# Altium project PCB_Project.PrjPcb
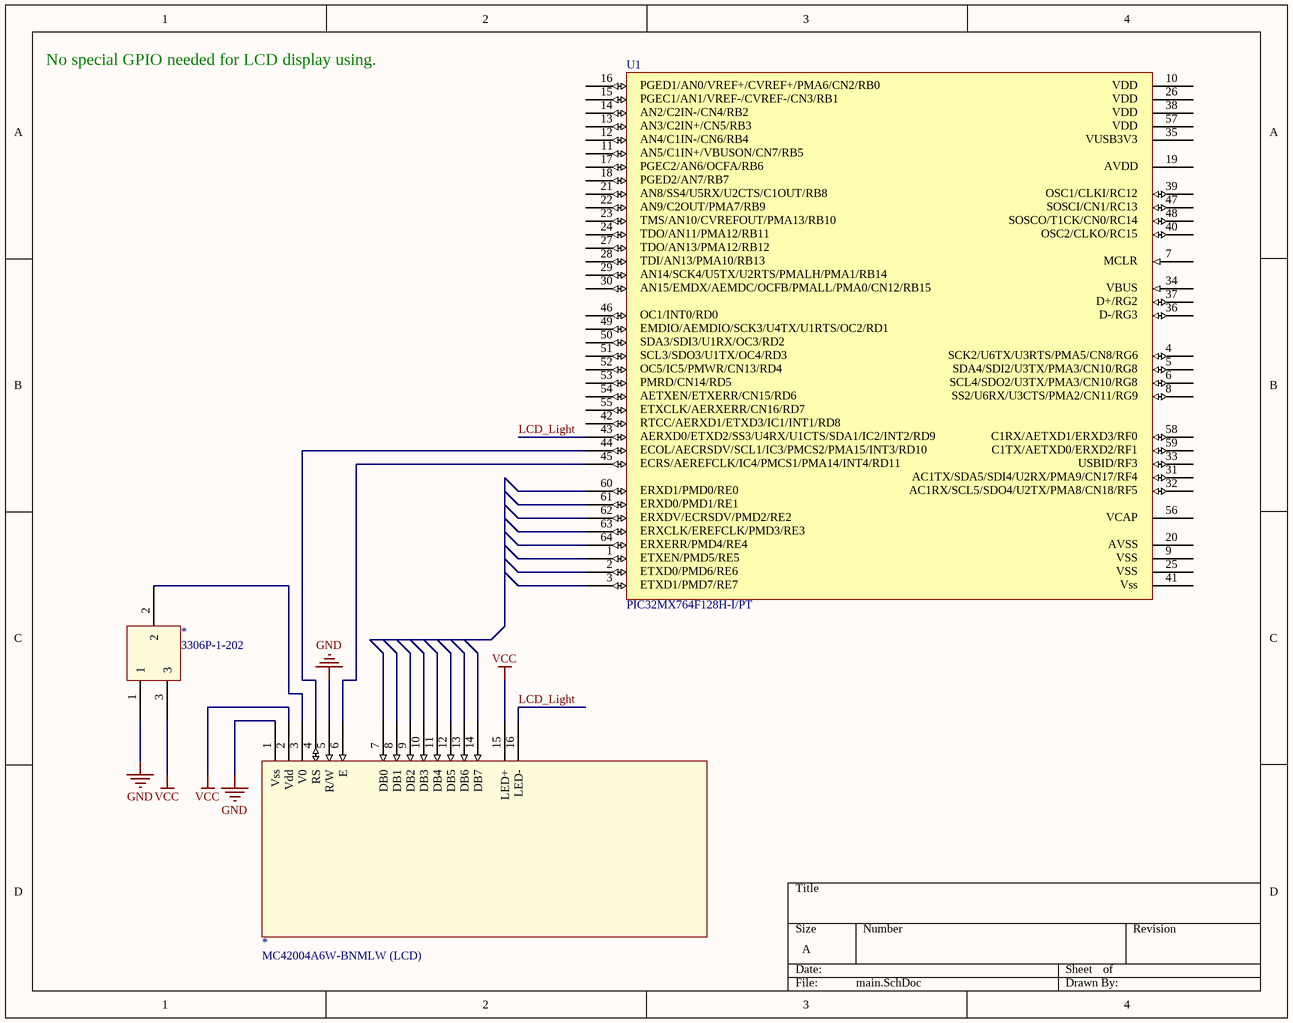
[diagram p0: main.SchDoc]
1 sheet, 3 parts. Net scope: global (net labels, ports and power ports of the same name join across sheets).

## Sheet main.SchDoc
size A

### Parts
(Parts that share a designator on the sheet are numbered #1, #2 ... from top to bottom, then left to right.)
*#1  3306P-1-202  [3306P-1-202]
*#2  MC42004A6W-BNMLW (LCD)  [PCBComponent_1]
U1  PIC32MX764F128H-I/PT

### Nets
GND: *#1.1 *#2.1(Vss) *#2.5(R/W)
VCC: *#1.3 *#2.2(Vdd) *#2.15(LED+)
LCD_Light: *#2.16(LED-) U1.43
Net*#1_2: *#1.2 *#2.3(V0)
Net*#2_4: *#2.4(RS) U1.44
Net*#2_6: *#2.6(E) U1.45

Not connected (* = marked no-connect by the designer): *#2 7(DB0) 8(DB1) 9(DB2) 10(DB3) 11(DB4) 12(DB5) 13(DB6) 14(DB7); U1 1 2 3 4 5 6 7 8 9 10 11 12 13 14 15 16 17 18 19 20 21 22 23 24 25 26 27 28 29 30 31 32 33 34 35 36 37 38 39 40 41 42 46 47 48 49 50 51 52 53 54 55 56 57 58 59 60 61 62 63 64

### Notes on the sheet
- No special GPIO needed for LCD display using.
- (in symbol PIC32MX764F128H-I/PT) PGED1/AN0/VREF+/CVREF+/PMA6/CN2/RB0; VDD; PGEC1/AN1/VREF-/CVREF-/CN3/RB1; AN2/C2IN-/CN4/RB2; AN3/C2IN+/CN5/RB3; AN4/C1IN-/CN6/RB4; VUSB3V3; AN5/C1IN+/VBUSON/CN7/RB5; PGEC2/AN6/OCFA/RB6; AVDD; PGED2/AN7/RB7; AN8/SS4/U5RX/U2CTS/C1OUT/RB8; OSC1/CLKI/RC12; AN9/C2OUT/PMA7/RB9; SOSCI/CN1/RC13; TMS/AN10/CVREFOUT/PMA13/RB10; SOSCO/T1CK/CN0/RC14; TDO/AN11/PMA12/RB11; OSC2/CLKO/RC15; TDO/AN13/PMA12/RB12; TDI/AN13/PMA10/RB13; MCLR; AN14/SCK4/U5TX/U2RTS/PMALH/PMA1/RB14; AN15/EMDX/AEMDC/OCFB/PMALL/PMA0/CN12/RB15; VBUS; D+/RG2; OC1/INT0/RD0; D-/RG3; EMDIO/AEMDIO/SCK3/U4TX/U1RTS/OC2/RD1; SDA3/SDI3/U1RX/OC3/RD2; SCL3/SDO3/U1TX/OC4/RD3; SCK2/U6TX/U3RTS/PMA5/CN8/RG6; OC5/IC5/PMWR/CN13/RD4; SDA4/SDI2/U3TX/PMA3/CN10/RG8; PMRD/CN14/RD5; SCL4/SDO2/U3TX/PMA3/CN10/RG8; AETXEN/ETXERR/CN15/RD6; SS2/U6RX/U3CTS/PMA2/CN11/RG9; ETXCLK/AERXERR/CN16/RD7; RTCC/AERXD1/ETXD3/IC1/INT1/RD8; AERXD0/ETXD2/SS3/U4RX/U1CTS/SDA1/IC2/INT2/RD9; C1RX/AETXD1/ERXD3/RF0; ECOL/AECRSDV/SCL1/IC3/PMCS2/PMA15/INT3/RD10; C1TX/AETXD0/ERXD2/RF1; ECRS/AEREFCLK/IC4/PMCS1/PMA14/INT4/RD11; USBID/RF3; AC1TX/SDA5/SDI4/U2RX/PMA9/CN17/RF4; ERXD1/PMD0/RE0; AC1RX/SCL5/SDO4/U2TX/PMA8/CN18/RF5; ERXD0/PMD1/RE1; ERXDV/ECRSDV/PMD2/RE2; VCAP; ERXCLK/EREFCLK/PMD3/RE3; ERXERR/PMD4/RE4; AVSS; ETXEN/PMD5/RE5; VSS; ETXD0/PMD6/RE6; ETXD1/PMD7/RE7; Vss

### Library data of the parts
U1 = PIC32MX764F128H-I/PT: PIC32MX764F128H; Fabricant: Microchip; Fournisseur: Farnell; RefFournisseur: 1971889; Footprint: QFP50P1200X1200X120-64; RefFabricant: PIC32MX764F128H-I/PT